# Altium schematic sheet CurrentSources.SchDoc
size A4; CarNumber: 5; Author: Michał Kowalik; CompanyName: AGH; Engineer: dr inż. Piotr Otfinowski; DocumentNumber: 2; Revision: Rev; SheetNumber: 2; SheetTotal: 6; ProjectName: Project Name
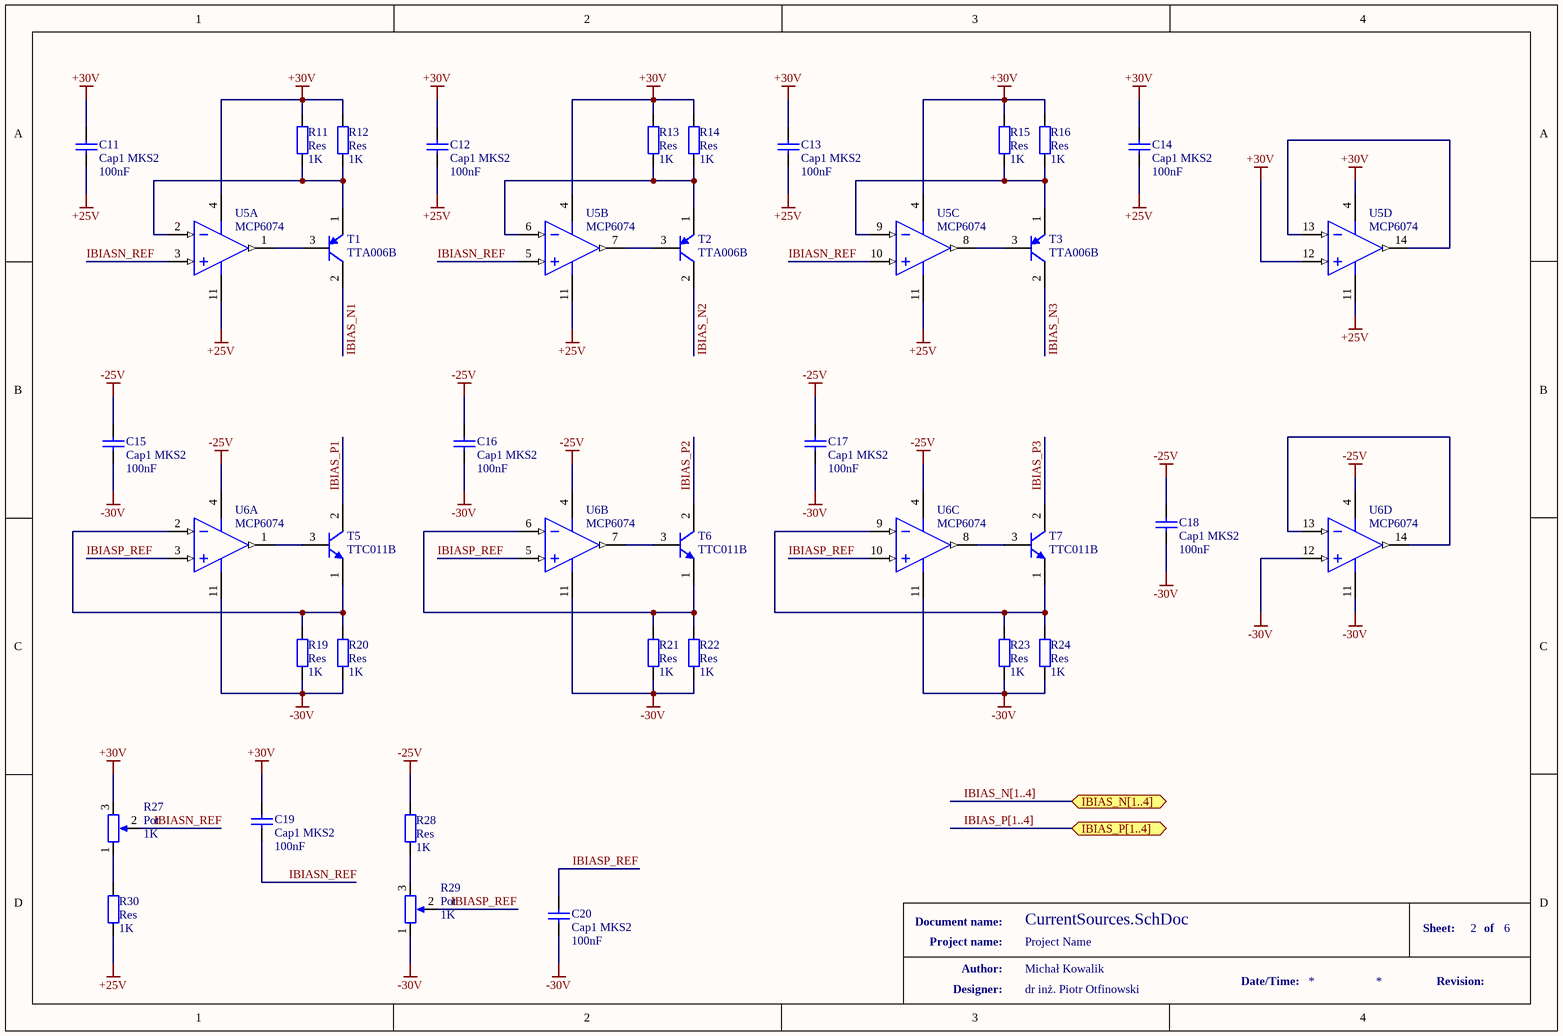
[diagram p0: CurrentSources.SchDoc]

## Parts
C11  Cap1 MKS2  value 100nF  [CAP-0.5-WIMA_MKS2]
C12  Cap1 MKS2  value 100nF  [CAP-0.5-WIMA_MKS2]
C13  Cap1 MKS2  value 100nF  [CAP-0.5-WIMA_MKS2]
C14  Cap1 MKS2  value 100nF  [CAP-0.5-WIMA_MKS2]
C15  Cap1 MKS2  value 100nF  [CAP-0.5-WIMA_MKS2]
C16  Cap1 MKS2  value 100nF  [CAP-0.5-WIMA_MKS2]
C17  Cap1 MKS2  value 100nF  [CAP-0.5-WIMA_MKS2]
C18  Cap1 MKS2  value 100nF  [CAP-0.5-WIMA_MKS2]
C19  Cap1 MKS2  value 100nF  [CAP-0.5-WIMA_MKS2]
C20  Cap1 MKS2  value 100nF  [CAP-0.5-WIMA_MKS2]
R11  Res  value 1K  [RESISTOR-10mm]
R12  Res  value 1K  [RESISTOR-10mm]
R13  Res  value 1K  [RESISTOR-10mm]
R14  Res  value 1K  [RESISTOR-10mm]
R15  Res  value 1K  [RESISTOR-10mm]
R16  Res  value 1K  [RESISTOR-10mm]
R19  Res  value 1K  [RESISTOR-10mm]
R20  Res  value 1K  [RESISTOR-10mm]
R21  Res  value 1K  [RESISTOR-10mm]
R22  Res  value 1K  [RESISTOR-10mm]
R23  Res  value 1K  [RESISTOR-10mm]
R24  Res  value 1K  [RESISTOR-10mm]
R27  Pot  value 1K  [T910W]
R28  Res  value 1K  [RESISTOR-10mm]
R29  Pot  value 1K  [T910W]
R30  Res  value 1K  [RESISTOR-10mm]
T1  TTA006B  [TO-126]
T2  TTA006B  [TO-126]
T3  TTA006B  [TO-126]
T5  TTC011B  [TO-126]
T6  TTC011B  [TO-126]
T7  TTC011B  [TO-126]
U5  MCP6074  [SO_14_IPC_MD]  (parts A,B,C,D of 4)
U6  MCP6074  [SO_14_IPC_MD]  (parts A,B,C,D of 4)

## Ports
IBIAS_N[1..4] (bidir), IBIAS_P[1..4] (bidir)

## Nets
+25V: C11.1 C12.1 C13.1 C14.1 R30.1 U5.11(VSS)
+30V: C11.2 C12.2 C13.2 C14.2 C19.2 R11.2 R12.2 R13.2 R14.2 R15.2 R16.2 R27.3 U5.4(VDD) U5.12(VIND+)
-25V: C15.2 C16.2 C17.2 C18.2 R28.2 U6.4(VDD)
-30V: C15.1 C16.1 C17.1 C18.1 C20.1 R19.1 R20.1 R21.1 R22.1 R23.1 R24.1 R29.1 U6.11(VSS) U6.12(VIND+)
IBIAS_N1: T1.2(C)
IBIAS_N2: T2.2(C)
IBIAS_N3: T3.2(C)
IBIAS_P1: T5.2(C)
IBIAS_P2: T6.2(C)
IBIAS_P3: T7.2(C)
IBIASN_REF: C19.1 R27.2 U5.3(VINA+) U5.5(VINB+) U5.10(VINC+)
IBIASP_REF: C20.2 R29.2 U6.3(VINA+) U6.5(VINB+) U6.10(VINC+)
NetR11_1: R11.1 R12.1 T1.1(E) U5.2(VINA-)
NetR13_1: R13.1 R14.1 T2.1(E) U5.6(VINB-)
NetR15_1: R15.1 R16.1 T3.1(E) U5.9(VINC-)
NetR19_2: R19.2 R20.2 T5.1(E) U6.2(VINA-)
NetR21_2: R21.2 R22.2 T6.1(E) U6.6(VINB-)
NetR23_2: R23.2 R24.2 T7.1(E) U6.9(VINC-)
NetR27_1: R27.1 R30.2
NetR28_1: R28.1 R29.3
NetT1_3: T1.3(B) U5.1(VOUTA)
NetT2_3: T2.3(B) U5.7(VOUTB)
NetT3_3: T3.3(B) U5.8(VOUTC)
NetT5_3: T5.3(B) U6.1(VOUTA)
NetT6_3: T6.3(B) U6.7(VOUTB)
NetT7_3: T7.3(B) U6.8(VOUTC)
NetU5_13: U5.13(VIND-) U5.14(VOUTD)
NetU6_13: U6.13(VIND-) U6.14(VOUTD)

## Buses and harness runs
bus IBIAS_N[1..4] = port IBIAS_N[1..4]
bus IBIAS_P[1..4] = port IBIAS_P[1..4]

## Notes on the sheet
- Document name:
- Project name:
- Author:
- Date/Time:
- Sheet:
- Revision:
- of
- Designer:

## Library data of the parts
C11-C20 = Cap1: WIMA MKS2 Metallized Polyester (PET) / Capacitors in PCM 5 mm
R11-R16 R19-R24 R28 R30 = Res: Resistor
R27 R29 = Pot: Potentiometer
T1-T3 = TTA006B: PNP High Voltage Transistor; ComponentLink1Description: Manufacturer Link; ComponentLink1URL: http://www.fairchildsemi.com/; ComponentLink2Description: Datasheet; ComponentLink2URL: http://www.fairchildsemi.com/ds/2N%2F2N3906.pdf
T5-T7 = TTC011B: NPN High Voltage Transistor; ComponentLink1Description: Manufacturer Link; ComponentLink1URL: http://www.fairchildsemi.com/; ComponentLink2Description: Datasheet; ComponentLink2URL: http://www.fairchildsemi.com/ds/2N%2F2N3904.pdf
U5 U6 = MCP6074: 110 µA, High Precision Quad Op Amp, 14-Pin SOIC, Extended Temperature, Tape and Reel; Published: 2-Dec-2009; DatasheetVersion: revA, Mar-2009; PackageVersion: revBB, Aug-2009; PackageReference: SOIC-SL14; Publisher: Altium Limited; PackageDescription: 14-Lead Plastic Small Outline (SL) - Narrow, 3.90mm Body [SOIC]; Supplier 1: Digi-Key; Supplier Part Number 1: MCP6074T-E/SL-ND; Code_JEDEC: MS-012-AB; Code_IPC: SOIC127P600-14; ComponentLink1Description: Datasheet; ComponentLink1URL: http://ww1.microchip.com/downloads/en/DeviceDoc/22142a.pdf; ComponentLink2Description: Packaging Specification; ComponentLink2URL: http://www.microchip.com/stellent/groups/techpub_sg/documents/packagingspec/en012702.pdf; ComponentLink3Description: Microchip.com Home; ComponentLink3URL: http://www.microchip.com/